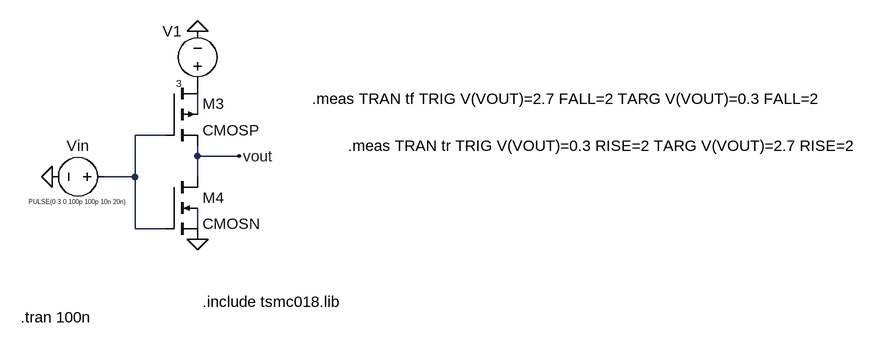
[diagram p0: schematic Draft2.asc]
Draft2.asc, the LTspice schematic file:
Version 4
SHEET 1 1200 680
WIRE 32 -240 32 -272
WIRE -16 -208 -64 -208
WIRE 32 -176 32 -192
WIRE 96 -176 32 -176
WIRE -64 -144 -64 -208
WIRE -64 -144 -112 -144
WIRE 32 -144 32 -176
WIRE -64 -64 -64 -144
WIRE -16 -64 -64 -64
WIRE 32 -64 32 -96
FLAG -192 -144 0
FLAG 32 -368 0
FLAG 32 -48 0
FLAG 96 -176 vout
SYMBOL voltage -96 -144 M270
WINDOW 0 32 56 VTop 2
WINDOW 3 -32 56 VBottom 0
WINDOW 123 0 0 Left 0
WINDOW 39 0 0 Left 0
SYMATTR InstName Vin
SYMATTR Value PULSE(0 3 0 100p 100p 10n 20n)
SYMBOL voltage 32 -272 R180
WINDOW 0 24 96 Left 2
WINDOW 3 24 16 Left 1
WINDOW 123 0 0 Left 0
WINDOW 39 0 0 Left 0
SYMATTR InstName V1
SYMATTR Value 3
SYMBOL pmos4 -16 -288 R0
SYMATTR InstName M3
SYMATTR Value CMOSP
SYMBOL nmos4 -16 -144 R0
SYMATTR InstName M4
SYMATTR Value CMOSN
TEXT 40 48 Left 2 !.include tsmc018.lib
TEXT -240 72 Left 2 !.tran 100n
TEXT 208 -264 Left 2 !.meas TRAN tf TRIG V(VOUT)=2.7 FALL=2 TARG V(VOUT)=0.3 FALL=2
TEXT 264 -192 Left 2 !.meas TRAN tr TRIG V(VOUT)=0.3 RISE=2 TARG V(VOUT)=2.7 RISE=2

The netlist it stands for:
* Draft2.asc
Vin N002 0 PULSE(0 3 0 100p 100p 10n 20n)
V1 P001 0 3
M3 P001 N002 vout N001 CMOSP
M4 vout N002 0 N003 CMOSN
.model NMOS NMOS
.model PMOS PMOS
.lib standard.mos
.include tsmc018.lib
.tran 100n
.meas TRAN tf TRIG V(VOUT)=2.7 FALL=2 TARG V(VOUT)=0.3 FALL=2
.meas TRAN tr TRIG V(VOUT)=0.3 RISE=2 TARG V(VOUT)=2.7 RISE=2
.backanno
.end